# Altium project C210 Rev_B_220601.PrjPcb (part 5 of 5)
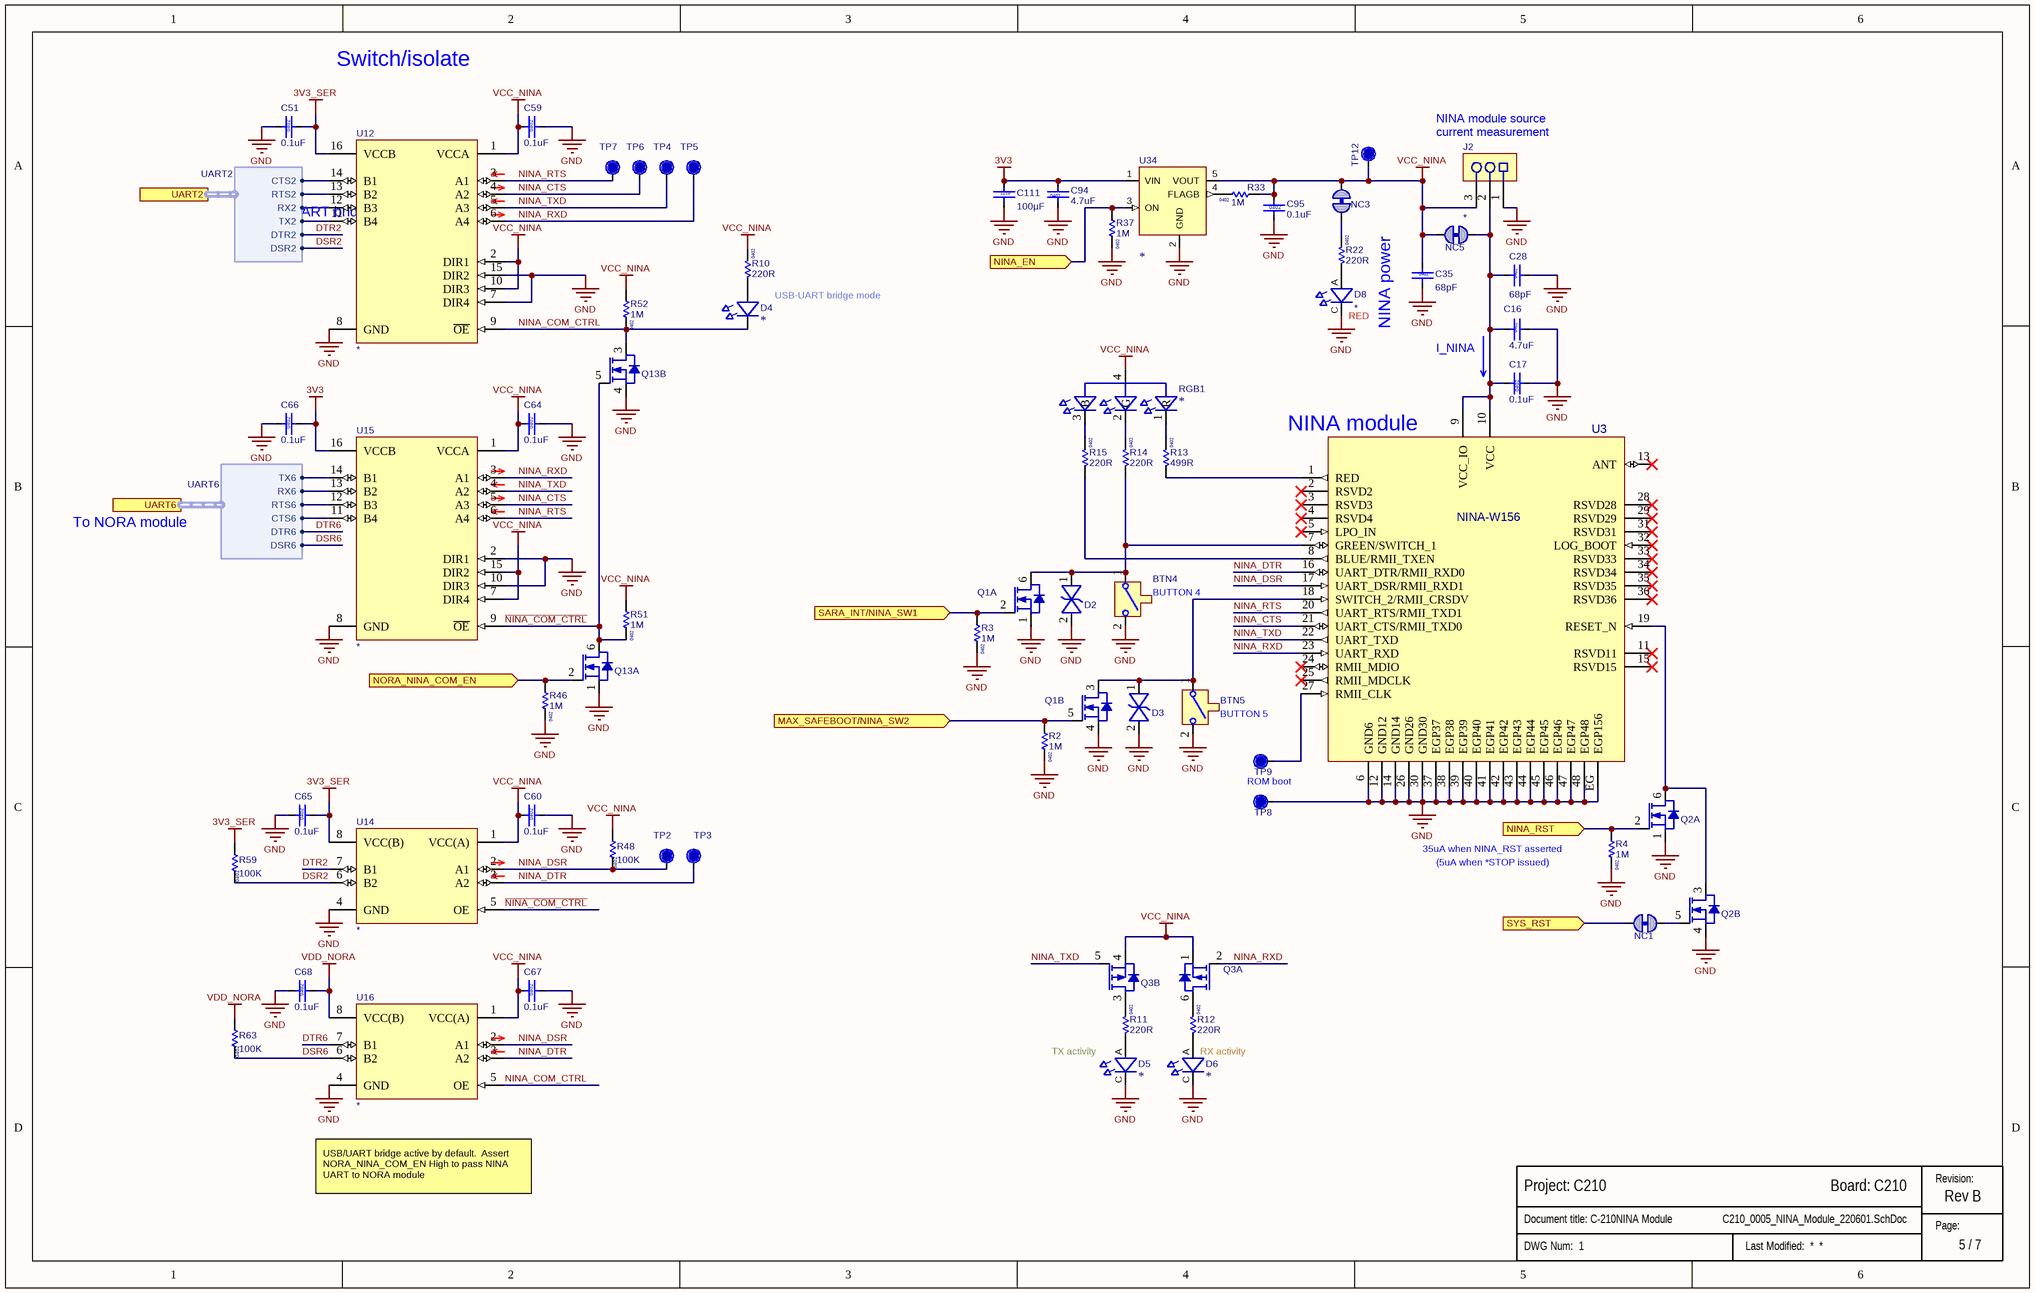
[diagram p8: C210_0005_NINA_Module_220601.SchDoc]

## Nets that join several sheets
3V3: C210_0002_NORA_Module_220601 (17 pins), C210_0003_SARA_Module_220601 (5 pins), C210_0006_Power_220601 (7 pins), C210_0007_Sensors_220601 (43 pins), C210_0001_Serial_Interface_220601 (Q21.4 R90.1), C210_0004_MAX_Module_220601 (6 pins), C210_0005_NINA_Module_220601 (5 pins)
3V3_SER: C210_0002_NORA_Module_220601 (C46.1 U9.1 U9.2 U9.10), C210_0003_SARA_Module_220601 (7 pins), C210_0001_Serial_Interface_220601 (14 pins), C210_0004_MAX_Module_220601 (C78.2 R69.1 U20.8), C210_0005_NINA_Module_220601 (5 pins)
GND: C210_0000_Topsheet_220601 (STD1.1 STD2.1 STD3.1 STD4.1), C210_0002_NORA_Module_220601 (65 pins), C210_0003_SARA_Module_220601 (130 pins), C210_0006_Power_220601 (37 pins), C210_0007_Sensors_220601 (49 pins), C210_0001_Serial_Interface_220601 (53 pins), C210_0004_MAX_Module_220601 (70 pins), C210_0005_NINA_Module_220601 (62 pins)
SARA_1V8: C210_0003_SARA_Module_220601 (15 pins), C210_0004_MAX_Module_220601 (5 pins)
V_BAT: C210_0003_SARA_Module_220601 (Q9.2 R32.2), C210_0006_Power_220601 (12 pins)
VBUS: C210_0002_NORA_Module_220601 (Q18.4 R80.1), C210_0003_SARA_Module_220601 (Q15.4 R49.1), C210_0006_Power_220601 (C61.1 U10.6 U10.13), C210_0001_Serial_Interface_220601 (10 pins)
VDD_NORA: C210_0002_NORA_Module_220601 (11 pins), C210_0004_MAX_Module_220601 (C75.2 R78.1 U21.8), C210_0005_NINA_Module_220601 (C68.2 R63.1 U16.8)
ACCEL_INT: C210_0002_NORA_Module_220601 (U13.C8), C210_0007_Sensors_220601 (R111.2 R112.2 R114.2 TP38.1)
ALT_INT: C210_0002_NORA_Module_220601 (U13.A4), C210_0007_Sensors_220601 (5 pins)
CTS4: C210_0002_NORA_Module_220601 (U13.G1), C210_0003_SARA_Module_220601 (TP17.1 U5.13)
CTS6: C210_0002_NORA_Module_220601 (U13.H8), C210_0005_NINA_Module_220601 (U15.11)
DSR2: C210_0001_Serial_Interface_220601 (R35.2 U6.17), C210_0005_NINA_Module_220601 (R59.2 U14.6)
DSR6: C210_0002_NORA_Module_220601 (U13.H7), C210_0005_NINA_Module_220601 (R63.2 U16.6)
DTR2: C210_0001_Serial_Interface_220601 (U6.18), C210_0005_NINA_Module_220601 (U14.7)
DTR6: C210_0002_NORA_Module_220601 (U13.G8), C210_0005_NINA_Module_220601 (U16.7)
NetQ1_2: C210_0002_NORA_Module_220601 (U13.C4), C210_0003_SARA_Module_220601 (Q5.2 R17.2), C210_0005_NINA_Module_220601 (Q1.2 R3.1)
NetQ1_5: C210_0002_NORA_Module_220601 (U13.D3), C210_0004_MAX_Module_220601 (R81.2), C210_0005_NINA_Module_220601 (Q1.5 R2.1)
NetQ2_2: C210_0002_NORA_Module_220601 (U13.G7), C210_0005_NINA_Module_220601 (Q2.2 R4.1)
NetQ4_5: C210_0002_NORA_Module_220601 (U13.E3), C210_0003_SARA_Module_220601 (Q4.5 R16.1)
NetQ10_2: C210_0002_NORA_Module_220601 (U13.C1), C210_0003_SARA_Module_220601 (Q10.2 R31.1)
NetQ10_5: C210_0002_NORA_Module_220601 (U13.C2), C210_0003_SARA_Module_220601 (Q10.5 R34.1)
NetQ13_2: C210_0002_NORA_Module_220601 (U13.J7), C210_0005_NINA_Module_220601 (Q13.2 R46.1)
NetQ26_2: C210_0002_NORA_Module_220601 (U13.D8), C210_0004_MAX_Module_220601 (Q26.2 R115.1)
NetQ27_2: C210_0003_SARA_Module_220601 (U1.23), C210_0004_MAX_Module_220601 (Q27.2 R117.1)
NetR18_2: C210_0003_SARA_Module_220601 (U1.46), C210_0004_MAX_Module_220601 (R18.2 U22.7)
NetR37_1: C210_0002_NORA_Module_220601 (U13.B1), C210_0005_NINA_Module_220601 (R37.1 U34.3)
NetR50_2: C210_0002_NORA_Module_220601 (U13.A2), C210_0006_Power_220601 (R50.2 U11.A1)
NetR67_1: C210_0002_NORA_Module_220601 (U13.E9), C210_0004_MAX_Module_220601 (R67.1)
NetR69_2: C210_0001_Serial_Interface_220601 (U6.1), C210_0004_MAX_Module_220601 (R69.2 U20.7)
NetR83_2: C210_0002_NORA_Module_220601 (U13.F9), C210_0004_MAX_Module_220601 (R83.2)
NetTP13_1: C210_0003_SARA_Module_220601 (TP13.1 U1.26), C210_0004_MAX_Module_220601 (U19.7)
NetTP14_1: C210_0003_SARA_Module_220601 (TP14.1 U1.27), C210_0004_MAX_Module_220601 (U19.6)
NetTP20_1: C210_0003_SARA_Module_220601 (TP20.1 U4.5), C210_0001_Serial_Interface_220601 (U6.46)
NetTP21_1: C210_0003_SARA_Module_220601 (TP21.1 U4.6), C210_0001_Serial_Interface_220601 (U6.47)
NetU1_25: C210_0003_SARA_Module_220601 (U1.25), C210_0004_MAX_Module_220601 (U22.6)
NetU6_4: C210_0001_Serial_Interface_220601 (U6.4), C210_0004_MAX_Module_220601 (U20.6)
NetU6_13: C210_0001_Serial_Interface_220601 (U6.13), C210_0005_NINA_Module_220601 (U12.14)
NetU6_14: C210_0001_Serial_Interface_220601 (U6.14), C210_0005_NINA_Module_220601 (U12.13)
NetU6_15: C210_0001_Serial_Interface_220601 (U6.15), C210_0005_NINA_Module_220601 (U12.12)
NetU6_16: C210_0001_Serial_Interface_220601 (U6.16), C210_0005_NINA_Module_220601 (U12.11)
NetU6_54: C210_0002_NORA_Module_220601 (U9.6), C210_0001_Serial_Interface_220601 (U6.54)
NetU6_55: C210_0002_NORA_Module_220601 (U9.5), C210_0001_Serial_Interface_220601 (U6.55)
NetU6_56: C210_0002_NORA_Module_220601 (U9.4), C210_0001_Serial_Interface_220601 (U6.56)
NetU6_57: C210_0002_NORA_Module_220601 (U9.3), C210_0001_Serial_Interface_220601 (U6.57)
RTS4: C210_0002_NORA_Module_220601 (U13.F3), C210_0003_SARA_Module_220601 (TP22.1 U5.14)
RTS6: C210_0002_NORA_Module_220601 (U13.A5), C210_0005_NINA_Module_220601 (U15.12)
RX1/SARA_PRI_TX: C210_0003_SARA_Module_220601 (Q7.5 TP18.1 U4.3), C210_0001_Serial_Interface_220601 (U6.48)
RX4: C210_0002_NORA_Module_220601 (U13.G5), C210_0003_SARA_Module_220601 (Q6.5 TP16.1 U5.12)
RX5: C210_0002_NORA_Module_220601 (U13.F8), C210_0004_MAX_Module_220601 (R78.2 U21.7)
RX6: C210_0002_NORA_Module_220601 (U13.H9), C210_0005_NINA_Module_220601 (U15.13)
SENSE_I2C_SCL: C210_0002_NORA_Module_220601 (U13.B4), C210_0006_Power_220601 (U11.A3), C210_0007_Sensors_220601 (12 pins)
SENSE_I2C_SDA: C210_0002_NORA_Module_220601 (U13.A3), C210_0006_Power_220601 (U11.A2), C210_0007_Sensors_220601 (12 pins)
SYS_RST: C210_0002_NORA_Module_220601 (NC12.2), C210_0003_SARA_Module_220601 (NC4.2), C210_0006_Power_220601 (BTN3.1 R125.2 TP48.1), C210_0001_Serial_Interface_220601 (NC8.2 NC11.2), C210_0004_MAX_Module_220601 (NC10.2), C210_0005_NINA_Module_220601 (NC1.2)
TX1/SARA_PRI_RX: C210_0003_SARA_Module_220601 (Q7.2 TP19.1 U4.4), C210_0001_Serial_Interface_220601 (U6.49)
TX4: C210_0002_NORA_Module_220601 (U13.G4), C210_0003_SARA_Module_220601 (Q6.2 TP15.1 U5.11)
TX5: C210_0002_NORA_Module_220601 (U13.G9), C210_0004_MAX_Module_220601 (U21.6)
TX6: C210_0002_NORA_Module_220601 (U13.J9), C210_0005_NINA_Module_220601 (U15.14)
USB_DNR2_n: C210_0003_SARA_Module_220601 (U1.28), C210_0001_Serial_Interface_220601 (R8.1)
USB_DNR2_p: C210_0003_SARA_Module_220601 (U1.29), C210_0001_Serial_Interface_220601 (R9.1)
USB_DNR3_n: C210_0002_NORA_Module_220601 (U13.D9), C210_0001_Serial_Interface_220601 (R73.1)
USB_DNR3_p: C210_0002_NORA_Module_220601 (U13.C9), C210_0001_Serial_Interface_220601 (R74.1)

## Assembly variants
PCB: not fitted A1 A2 BTN1 BTN2 BTN3 BTN4 BTN5 C1 C2 C3 C4 C5 C6 C7 C8 C9 C10 C11 C12 C13 C14 C15 C16 C17 C18 C19 C20 C21 C22 C23 C24 C25 C26 C27 C28 C29 C30 C31 C32 C33 C34 C35 C36 C37 C38 C39 C40 C41 C42 C43 C44 C45 C46 C47 C48 C49 C50 C51 C52 C53 C54 C55 C56 C57 C58 C59 C60 C61 C62 C63 C64 C65 C66 C67 C68 C69 C70 C71 C72 C73 C74 C75 C76 C77 C78 C79 C80 C81 C82 C83 C84 C85 C86 C87 C88 C89 C90 C91 C92 C93 C94 C95 C96 C97 C98 C99 C100 C101 C102 C103 C104 C105 C106 C107 C108 C109 C110 C111 C112 C113 C114 C115 C116 C117 C118 C119 C120 C121 C122 C123 C124 C125 C126 C127 C128 C129 C130 C131 C132 C133 C134 C135 C136 C137 C138 C139 C140 C141 C142 D1 D2 D3 D4 D5 D6 D7 D8 D9 D10 D11 D12 D13 D14 D15 D16 D17 D18 D20 D21 D22 D23 D24 D25 D26 D27 D28 D29 ESIM F1 FB1 FB2 FB3 FB4 FB5 FB6 FB7 FB8 FB9 FB10 FD1 FD2 FD3 FD4 FD5 FD6 FIL1 FIL2 J1 J2 J3 J4 J5 J6 J7 J8 J9 J10 J11 J12 J13 J14 J15 J17 L1 L2 L3 NC1 NC2 NC3 NC4 NC5 NC6 NC7 NC8 NC9 NC10 NC11 NC12 NC13 NC14 NC15 NO1 NO3 NO4 NO5 NO6 P1 Q1 Q2 Q3 Q4 Q5 Q6 Q7 Q9 Q10 Q12 Q13 Q14 Q15 Q16 Q17 Q18 Q19 Q20 Q21 Q22 Q23 Q24 Q25 Q26 Q27 Q28 R1 R2 R3 R4 R5 R6 R7 R8 R9 R10 R11 R12 R13 R14 R15 R16 R17 R18 R19 R20 R21 R22 R23 R24 R25 R26 R27 R28 R29 R30 R31 R32 R33 R34 R35 R36 R37 R38 R39 R40 R41 R42 R43 R44 R45 R46 R47 R48 R49 R50 R51 R52 R53 R54 R55 R56 R57 R58 R59 R60 R61 R62 R63 R64 R65 R66 R67 R68 R69 R70 R71 R72 R73 R74 R75 R76 R77 R78 R79 R80 R81 R82 R83 R84 R85 R86 R87 R88 R89 R90 R91 R92 R93 R94 R95 R96 R97 R98 R99 R100 R101 R102 R103 R104 R105 R106 R107 R108 R109 R110 R111 R112 R113 R114 R115 R116 R117 R118 R119 R120 R121 R122 R123 R124 R125 R126 R127 R128 R129 RGB1 RGB2 RT1 STD1 STD2 STD3 STD4 SW1 SWC1 TP1 TP2 TP3 TP4 TP5 TP6 TP7 TP8 TP9 TP10 TP11 TP12 TP13 TP14 TP15 TP16 TP17 TP18 TP19 TP20 TP21 TP22 TP23 TP24 TP25 TP26 TP27 TP28 TP29 TP30 TP31 TP32 TP33 TP34 TP35 TP36 TP37 TP38 TP39 TP40 TP41 TP42 TP43 TP44 TP45 TP46 TP47 TP48 TP49 TP50 U1 U2 U3 U4 U5 U6 U7 U8 U9 U10 U11 U12 U13 U14 U15 U16 U17 U18 U19 U20 U21 U22 U23 U24 U25 U26 U27 U28 U29 U30 U31 U32 U33 U34 X1 X2 Z1 Z2 Z3 Z4 Z5 Z6
C210_SMT: not fitted A2 C3 C11 C103 C135 C136 C142 FD1 FD2 FD3 FD4 FD5 FD6 J15 J17 L1 NC1 NC2 NC3 NC4 NC5 NC6 NC7 NC8 NC9 NC10 NC11 NC12 NC13 NC14 NC15 NO1 NO3 NO4 NO5 NO6 R5 R7 R26 R27 R29 R30 R35 R36 R40 R41 R42 R55 R79 R88 R93 R98 R111 SW1 TP1 TP2 TP3 TP4 TP5 TP6 TP7 TP8 TP9 TP10 TP11 TP12 TP13 TP14 TP15 TP16 TP17 TP18 TP19 TP20 TP21 TP22 TP23 TP24 TP25 TP26 TP27 TP28 TP29 TP30 TP31 TP32 TP33 TP34 TP35 TP36 TP37 TP38 TP39 TP40 TP41 TP42 TP43 TP44 TP45 TP46 TP47 TP48 TP49 TP50 Z3 Z5 Z6
C210_TH: not fitted C3 C11 C103 C142 FD1 FD2 FD3 FD4 FD5 FD6 J15 J17 L1 NC1 NC2 NC3 NC4 NC5 NC6 NC7 NC8 NC9 NC10 NC11 NC12 NC13 NC14 NC15 NO1 NO3 NO4 NO5 NO6 R5 R7 R26 R27 R29 R30 R35 R36 R40 R41 R42 R55 R79 R88 R93 R98 R111 TP1 TP2 TP3 TP4 TP5 TP6 TP7 TP8 TP9 TP10 TP11 TP12 TP13 TP14 TP15 TP16 TP17 TP18 TP19 TP20 TP21 TP22 TP23 TP24 TP25 TP26 TP27 TP28 TP29 TP30 TP31 TP32 TP33 TP34 TP35 TP36 TP37 TP38 TP39 TP40 TP41 TP42 TP43 TP44 TP45 TP46 TP47 TP48 TP49 TP50 Z3 Z5 Z6
C210_TH_RELEASE: not fitted C3 C11 C103 C142 D18 J15 J17 L1 R5 R7 R26 R27 R29 R30 R35 R36 R40 R41 R42 R55 R79 R88 R93 R98 R111 Z3 Z5 Z6